# EAGLE design hev-controller 1.0 (EAGLE 6.1)
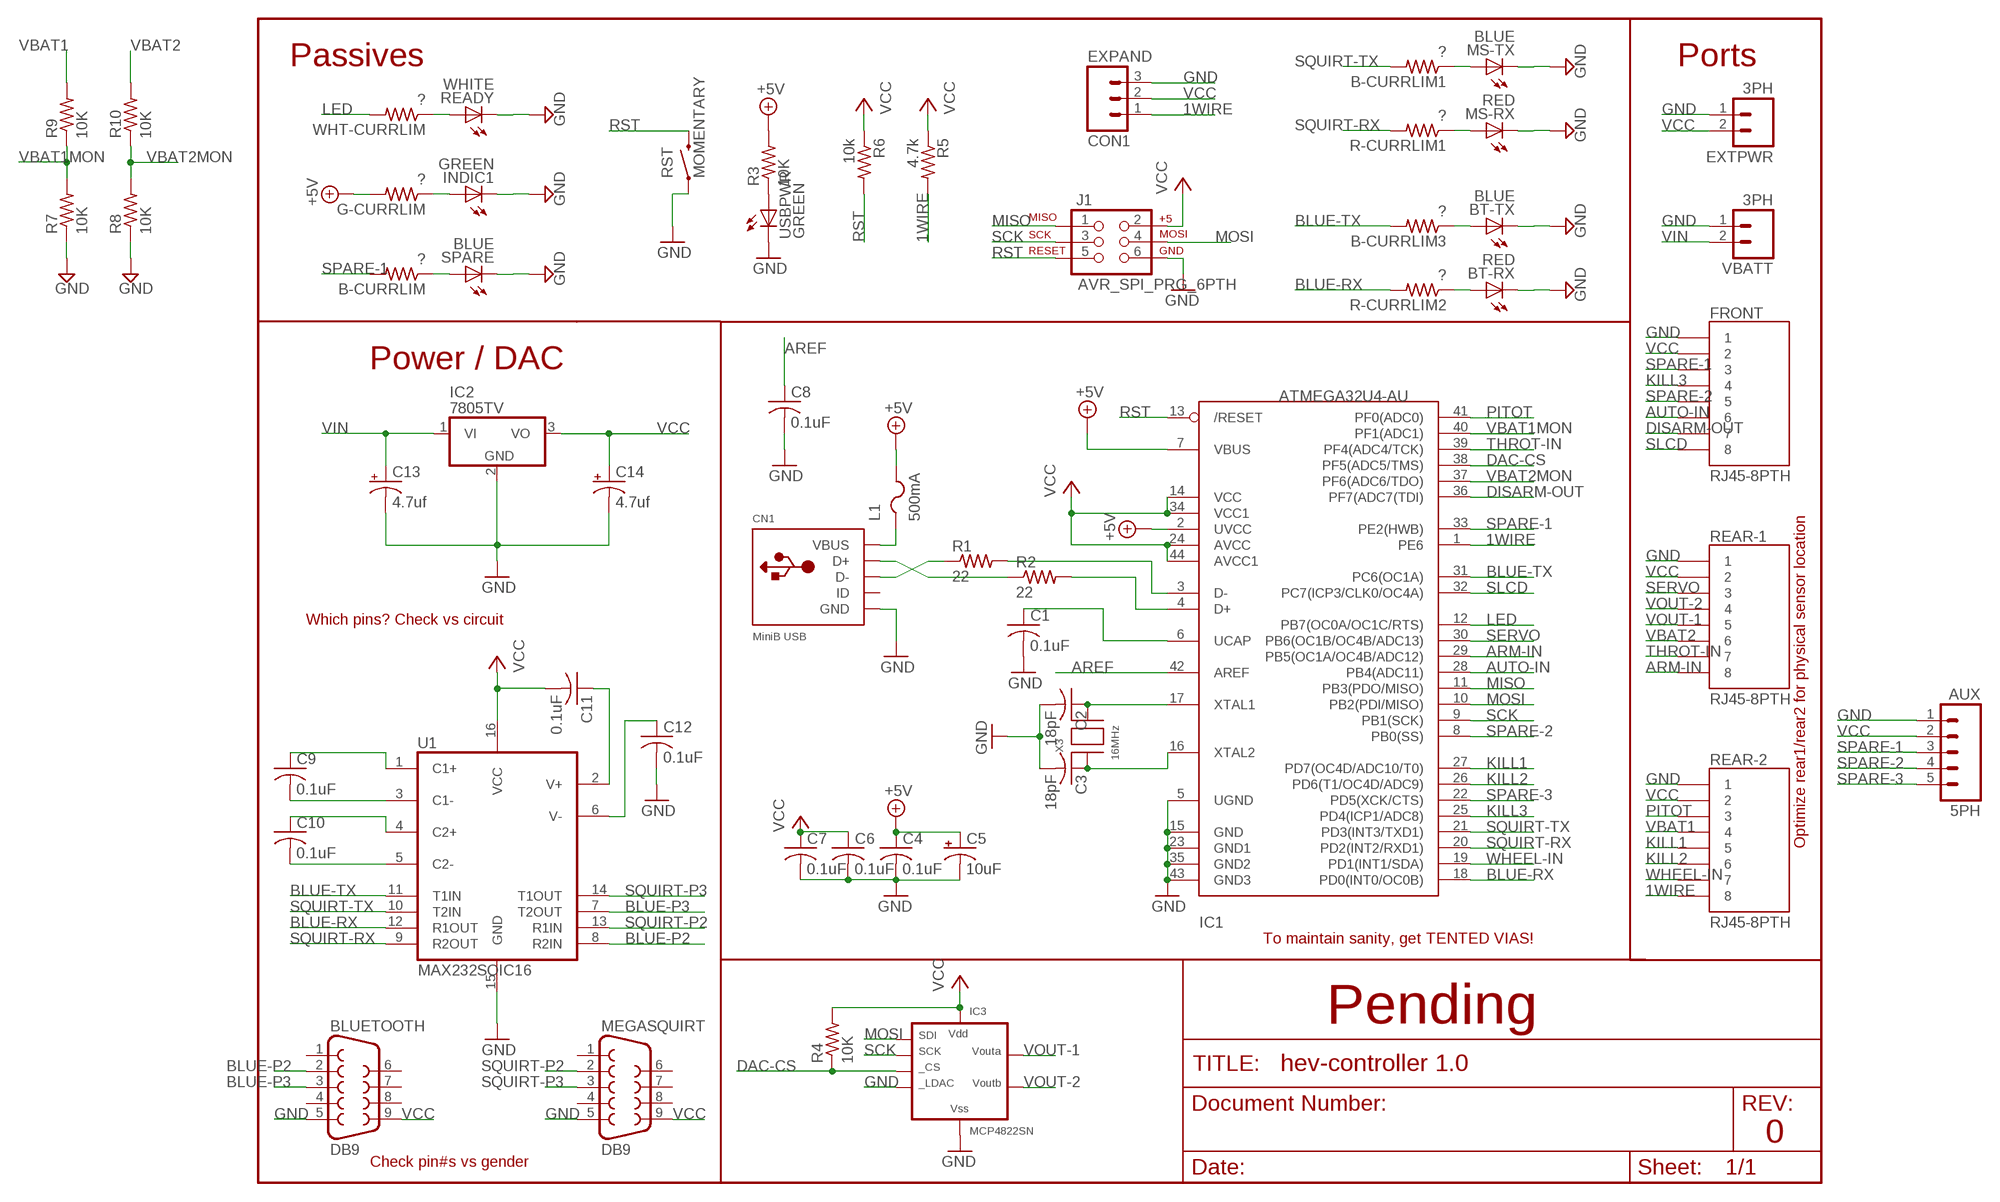
[diagram p0: schematic, sheet 1]

## Parts
5PH  AUX  M05PTH  [1X05]
B-CURRLIM  ?  R-US_R0805  [R0805]
B-CURRLIM1  ?  R-US_R0805  [R0805]
B-CURRLIM3  ?  R-US_R0805  [R0805]
BLUETOOTH  DB9  [DB9]
BT-RX  RED  LEDCHIPLED_0805  [CHIPLED_0805]
BT-TX  BLUE  LEDCHIPLED_0805  [CHIPLED_0805]
C1  0.1uF  C-USC0805K  [C0805K]
C2  18pF  C-USC0805K  [C0805K]
C3  18pF  C-USC0805K  [C0805K]
C4  0.1uF  C-USC0805K  [C0805K]
C5  10uF  CPOL-USA/3216-18R  [A/3216-18R]
C6  0.1uF  C-USC0805K  [C0805K]
C7  0.1uF  C-USC0805K  [C0805K]
C8  0.1uF  C-USC0805K  [C0805K]
C9  0.1uF  C-USC0805K  [C0805K]
C10  0.1uF  C-USC0805K  [C0805K]
C11  0.1uF  C-USC0805K  [C0805K]
C12  0.1uF  C-USC0805K  [C0805K]
C13  4.7uf  CPOL-USE2.5-6  [E2,5-6]
C14  4.7uf  CPOL-USE2.5-6  [E2,5-6]
CN1  MiniB USB  USBMINIB  [USB-MINIB]
EXPAND  CON1  M03POLAR  [MOLEX-1X3]
EXTPWR  3PH  M023.5MM  [SCREWTERMINAL-3.5MM-2]
FRONT  RJ45-8PTH  [RJ45-8]
G-CURRLIM  ?  R-US_R0805  [R0805]
IC1  ATMEGA32U4-AU  [TQFP44]
IC2  7805TV  [TO220V]
IC3  MCP4822SN  [SO-08]
INDIC1  GREEN  LEDCHIPLED_0805  [CHIPLED_0805]
J1  AVR_SPI_PRG_6PTH  [2X3]
L1  500mA  PTCFUSE-1206  [R1206]
MEGASQUIRT  DB9  [DB9]
MS-RX  RED  LEDCHIPLED_0805  [CHIPLED_0805]
MS-TX  BLUE  LEDCHIPLED_0805  [CHIPLED_0805]
R1  22  R-US_R0805  [R0805]
R2  22  R-US_R0805  [R0805]
R3  10K  R-US_R0805  [R0805]
R4  10K  R-US_R0805  [R0805]
R5  4.7k  R-US_R0805  [R0805]
R6  10k  R-US_R0805  [R0805]
R7  10K  R-US_R0805  [R0805]
R8  10K  R-US_R0805  [R0805]
R9  10K  R-US_R0805  [R0805]
R10  10K  R-US_R0805  [R0805]
R-CURRLIM1  ?  R-US_R0805  [R0805]
R-CURRLIM2  ?  R-US_R0805  [R0805]
READY  WHITE  LED1206  [LED-1206]
REAR-1  RJ45-8PTH  [RJ45-8]
REAR-2  RJ45-8PTH  [RJ45-8]
RST  MOMENTARY  SWITCH-MOMENTARY-2-SMD-1101NE  [TACTILE-SWITCH-1101NE]
SPARE  BLUE  LEDCHIPLED_0805  [CHIPLED_0805]
U1  MAX232SOIC16  [SO016]
USBPWR  GREEN  LEDCHIPLED_0805  [CHIPLED_0805]
VBATT  3PH  M023.5MM  [SCREWTERMINAL-3.5MM-2]
WHT-CURRLIM  ?  R-US_R0805  [R0805]
X3  16MHz  XTALNX5032  [NX5032]

## Nets
1WIRE: EXPAND.1 IC1.1(PE6) R5.2 REAR-2.8
+5V: C4.1 C5.+ G-CURRLIM.2 IC1.2(UVCC) IC1.7(VBUS) L1.2 R3.2
AREF: C8.1 IC1.42(AREF)
ARM-IN: IC1.29(PB5(OC1A/OC4B/ADC12)) REAR-1.8
AUTO-IN: FRONT.6 IC1.28(PB4(ADC11))
BLUE-P2: BLUETOOTH.2 U1.8(R2IN)
BLUE-P3: BLUETOOTH.3 U1.7(T2OUT)
BLUE-RX: IC1.18(PD0(INT0/OC0B)) R-CURRLIM2.2 U1.12(R1OUT)
BLUE-TX: B-CURRLIM3.2 IC1.31(PC6(OC1A)) U1.11(T1IN)
DAC-CS: IC1.38(PF5(ADC5/TMS)) IC3.2(CS) R4.1
DISARM-OUT: FRONT.7 IC1.36(PF7(ADC7(TDI))
GND [gnd]: 5PH.1 BLUETOOTH.5 BT-RX.C BT-TX.C C1.2 C2.2 C3.2 C4.2 C5.- C6.2 C7.2 C8.2 C12.2 C13.- C14.- CN1.GND EXPAND.3 EXTPWR.1 FRONT.1 IC1.5(UGND) IC1.15(GND) IC1.23(GND1) IC1.35(GND2) IC1.43(GND3) IC2.2(GND) IC3.5(LDAC) IC3.7(VSS) INDIC1.C J1.6 MEGASQUIRT.5 MS-RX.C MS-TX.C R7.1 R8.1 READY.C REAR-1.1 REAR-2.1 RST.P$1 SPARE.C U1.15(GND) USBPWR.C VBATT.1
KILL1: IC1.27(PD7(OC4D/ADC10/T0)) REAR-2.5
KILL2: IC1.26(PD6(T1/OC4D/ADC9)) REAR-2.6
KILL3: FRONT.4 IC1.25(PD4(ICP1/ADC8))
LED: IC1.12(PB7(OC0A/OC1C/RTS)) WHT-CURRLIM.2
MISO: IC1.11(PB3(PDO/MISO)) J1.1
MOSI: IC1.10(PB2(PDI/MISO)) IC3.4(SDI) J1.4
N$1: R3.1 USBPWR.A
N$2: CN1.D+ R2.1
N$3: IC1.3(D-) R1.2
N$4: IC1.4(D+) R2.2
N$5: CN1.D- R1.1
N$6: B-CURRLIM.1 SPARE.A
N$7: G-CURRLIM.1 INDIC1.A
N$8: C2.1 IC1.17(XTAL1) X3.P$2
N$9: C3.1 IC1.16(XTAL2) X3.P$1
N$10: B-CURRLIM1.1 MS-TX.A
N$11: MS-RX.A R-CURRLIM1.1
N$12: B-CURRLIM3.1 BT-TX.A
N$13: BT-RX.A R-CURRLIM2.1
N$25: READY.A WHT-CURRLIM.1
N$48: C9.1 U1.1(C1+)
N$49: C9.2 U1.3(C1-)
N$50: C10.1 U1.4(C2+)
N$51: C10.2 U1.5(C2-)
N$52: C11.1 U1.2(V+)
N$53: C12.1 U1.6(V-)
PITOT: IC1.41(PF0(ADC0)) REAR-2.3
RST: IC1.13(/RESET) J1.5 R6.2 RST.P$2
SCK: IC1.9(PB1(SCK)) IC3.3(SCK) J1.3
SERVO: IC1.30(PB6(OC1B/OC4B/ADC13)) REAR-1.3
SLCD: FRONT.8 IC1.32(PC7(ICP3/CLK0/OC4A))
SPARE-1: 5PH.3 B-CURRLIM.2 FRONT.3 IC1.33(PE2(HWB))
SPARE-2: 5PH.4 FRONT.5 IC1.8(PB0(SS))
SPARE-3: 5PH.5 IC1.22(PD5(XCK/CTS))
SQUIRT-P2: MEGASQUIRT.2 U1.13(R1IN)
SQUIRT-P3: MEGASQUIRT.3 U1.14(T1OUT)
SQUIRT-RX: IC1.20(PD2(INT2/RXD1)) R-CURRLIM1.2 U1.9(R2OUT)
SQUIRT-TX: B-CURRLIM1.2 IC1.21(PD3(INT3/TXD1)) U1.10(T2IN)
THROT-IN: IC1.39(PF4(ADC4/TCK)) REAR-1.7
UCAP: C1.1 IC1.6(UCAP)
VBAT1: R9.2 REAR-2.4
VBAT1MON: IC1.40(PF1(ADC1)) R7.2 R9.1
VBAT2: R10.2 REAR-1.6
VBAT2MON: IC1.37(PF6(ADC6/TDO)) R8.2 R10.1
VBUS: CN1.VBUS L1.1
VCC [power]: 5PH.2 BLUETOOTH.9 C6.1 C7.1 C11.2 C14.+ EXPAND.2 EXTPWR.2 FRONT.2 IC1.14(VCC) IC1.24(AVCC) IC1.34(VCC1) IC1.44(AVCC1) IC2.3(VO) IC3.1(VDD) J1.2 MEGASQUIRT.9 R4.2 R5.1 R6.1 REAR-1.2 REAR-2.2 U1.16(VCC)
VIN [power]: C13.+ IC2.1(VI) VBATT.2
VOUT-1: IC3.8(VOUTA) REAR-1.5
VOUT-2: IC3.6(VOUTB) REAR-1.4
WHEEL-IN: IC1.19(PD1(INT1/SDA)) REAR-2.7
Unconnected: BLUETOOTH.1 BLUETOOTH.4 BLUETOOTH.6 BLUETOOTH.7 BLUETOOTH.8 CN1.ID MEGASQUIRT.1 MEGASQUIRT.4 MEGASQUIRT.6 MEGASQUIRT.7 MEGASQUIRT.8

## Notes on the sheet
- Passives | Ports
- Power / DAC
- Which pins? Check vs circuit
- Optimize rear1/rear2 for physical sensor location
- To maintain sanity, get TENTED VIAS!
- Pending
- 0
- Check pin#s vs gender

## Library data of the parts
5PH = SparkFun:M05: Header 5 Standard 5-pin 0.1" header. Use with straight break away headers (SKU : PRT-00116), right angle break away headers (PRT-00553), swiss pins (PRT-00743), machine pins (PRT-00117), and female headers (PRT-00115). Molex polarized connector foot print use with SKU : PRT-08230 with associated crimp pins and housings.
B-CURRLIM B-CURRLIM1 B-CURRLIM3 G-CURRLIM R1-R10 R-CURRLIM1 R-CURRLIM2 WHT-CURRLIM = adafruit:R-US_: RESISTOR, American symbol
BLUETOOTH MEGASQUIRT = SparkFun:DB9: DB9 Connector Standard DB9 (D-Sub 9) serial connector. Can be used for CAN bus as well as RS485 and RS232. Footprint production proven. Spark Fun Electronics SKU : PRT-00429
BT-RX BT-TX INDIC1 MS-RX MS-TX SPARE USBPWR = adafruit:LED: LED OSRAM: - CHIPLED LG R971, LG N971, LY N971, LG Q971, LY Q971, LO R971, LY R971 LH N974, LH R974 LS Q976, LO Q976, LY Q976 LO Q996 - Hyper CHIPLED LW Q18S LB Q993, LB Q99A, LB R99A - SideLED LS A670, LO A670, LY A670, LG A670, LP A670 LB A673, LV A673, LT A673, LW A673 LH A674 LY A675 LS A676, LA A676, LO A676, LY A676, LW A676 LS A679, LY A679, LG A679 - Hyper Micro SIDELED® LS Y876, LA Y876, LO Y876, LY Y876 LT Y87S - SmartLED LW L88C, LW L88S LB L89C, LB L89S, LG L890 LS L89K, LO L89K, LY L89K LS L896, LA L896, LO L896, LY L896 - TOPLED LS T670, LO T670, LY T670, LG T670, LP T670 LSG T670, LSP T670, LSY T670, LOP T670, LYG T670 LG T671, LOG T671, LSG T671 LB T673, LV T673, LT T673, LW T673 LH T674 LS T676, LA T676, LO T676, LY T676, LB T676, LH T676, LSB T676, LW T676 LB T67C, LV T67C, LT T67C, LS T67K, LO T67K, LY T67K, LW E67C LS E67B, LA E67B, LO E67B, LY E67B, LB E67C, LV E67C, LT E67C LW T67C LS T679, LY T679, LG T679 LS T770, LO T770, LY T770, LG T770, LP T770 LB T773, LV T773, LT T773, LW T773 LH T774 LS E675, LA E675, LY E675, LS T675 LS T776, LA T776, LO T776, LY T776, LB T776 LHGB T686 LT T68C, LB T68C - Hyper Mini TOPLED® LB M676 - Mini TOPLED Santana® LG M470 LS M47K, LO M47K, LY M47K Source: http://www.osram.convergy.de/
C1-C4 C6-C12 = adafruit:C-US: CAPACITOR, American symbol
C5 = adafruit:CPOL-US: POLARIZED CAPACITOR, American symbol
C13 C14 = rcl:CPOL-US: POLARIZED CAPACITOR, American symbol
CN1 = adafruit:USB: USB Connectors USBMINIB - Surface Mount Female Mini-B USB Connector 4UConnector: 06564 By microbuilder.eu Thru-hole RA Female Mini-B USB Connector 4UConnector: 18732 By ladyada.net
EXPAND = SparkFun:M03: Header 3 Standard 3-pin 0.1" header. Use with straight break away headers (SKU : PRT-00116), right angle break away headers (PRT-00553), swiss pins (PRT-00743), machine pins (PRT-00117), and female headers (PRT-00115). Molex polarized connector foot print use with SKU : PRT-08232 with associated crimp pins and housings.
EXTPWR VBATT = SparkFun:M02: Header 2 Standard 2-pin 0.1" header. Use with straight break away headers (SKU : PRT-00116), right angle break away headers (PRT-00553), swiss pins (PRT-00743), machine pins (PRT-00117), and female headers (PRT-00115). Molex polarized connector foot print use with SKU : PRT-08233 with associated crimp pins and housings.
FRONT REAR-1 REAR-2 = SparkFun:RJ45-8: RJ45 Jack Simple RJ45, 8-pin connection - connector for common Cat5, Cat5e, and Cat6 Ethernet cables. Footprint not yet proven in production. Connector sku is PRT-00643; Breakout PCB sku is BOB-00716.
IC1 = adaprog:ATMEGA32U4
IC2 = linear:78*: Positive VOLTAGE REGULATOR Source: http://cache.national.com/ds/LM/LM78L05.pdf http://www.fairchildsemi.com/ds/LM/LM7805.pdf
IC3 = microchip-dac:MCP4822: MCP4822: 12-bit dual DAC MCP4802/4812/4822 - 8/10/12-Bit Dual Voltage Output Digital-to-Analog Converter with Internal VREF and SPI Interface The MCP48x2 devices are dual 8-bit, 10-bit and 12-bit buffered voltage output Digital-to-Analog Converters (DACs), respectively. The devices operate from a single 2.7V to 5.5V supply with SPI compatible Serial Peripheral Interface. The devices have a high precision internal voltage reference (VREF = 2.048V). The user can configure the full-scale range of the device to be 2.048V or 4.096V by setting the Gain Selection Option bit (gain of 1 of 2). RobG
J1 = SparkFun:AVR_SPI_PRG_6: AVR ISP 6 Pin This is the reduced ISP connector for AVR programming. Common on Arduino. This footprint will take up less PCB space and can be used with a 10-pin to 6-pin adapter such as SKU: BOB-08508
L1 = adafruit:PTCFUSE: PTC fuses, resettable thermistors
READY = SparkFun:LED: LEDs Standard schematic elements and footprints for 5mm, 3mm, 1206, and 0603 sized LEDs. 5mm - Spark Fun Electronics SKU : COM-00529 (and others)
RST = SparkFun:SWITCH-MOMENTARY-2
U1 = SparkFun:MAX232: RS232 Transceiver Very common IC. This is generically called 'MAX232', but works with the 3V equivalent MAX3232 generic ICs. Field tested and mother approved. Spark Fun Electronics SKU : COM-00316 (DIP) and COM-00589 (SMD)
X3 = adaprog:XTAL

## Net classes
0 default: width 0.254 mm
1 power: width 0.508 mm
2 gnd: width 0.508 mm

## Board
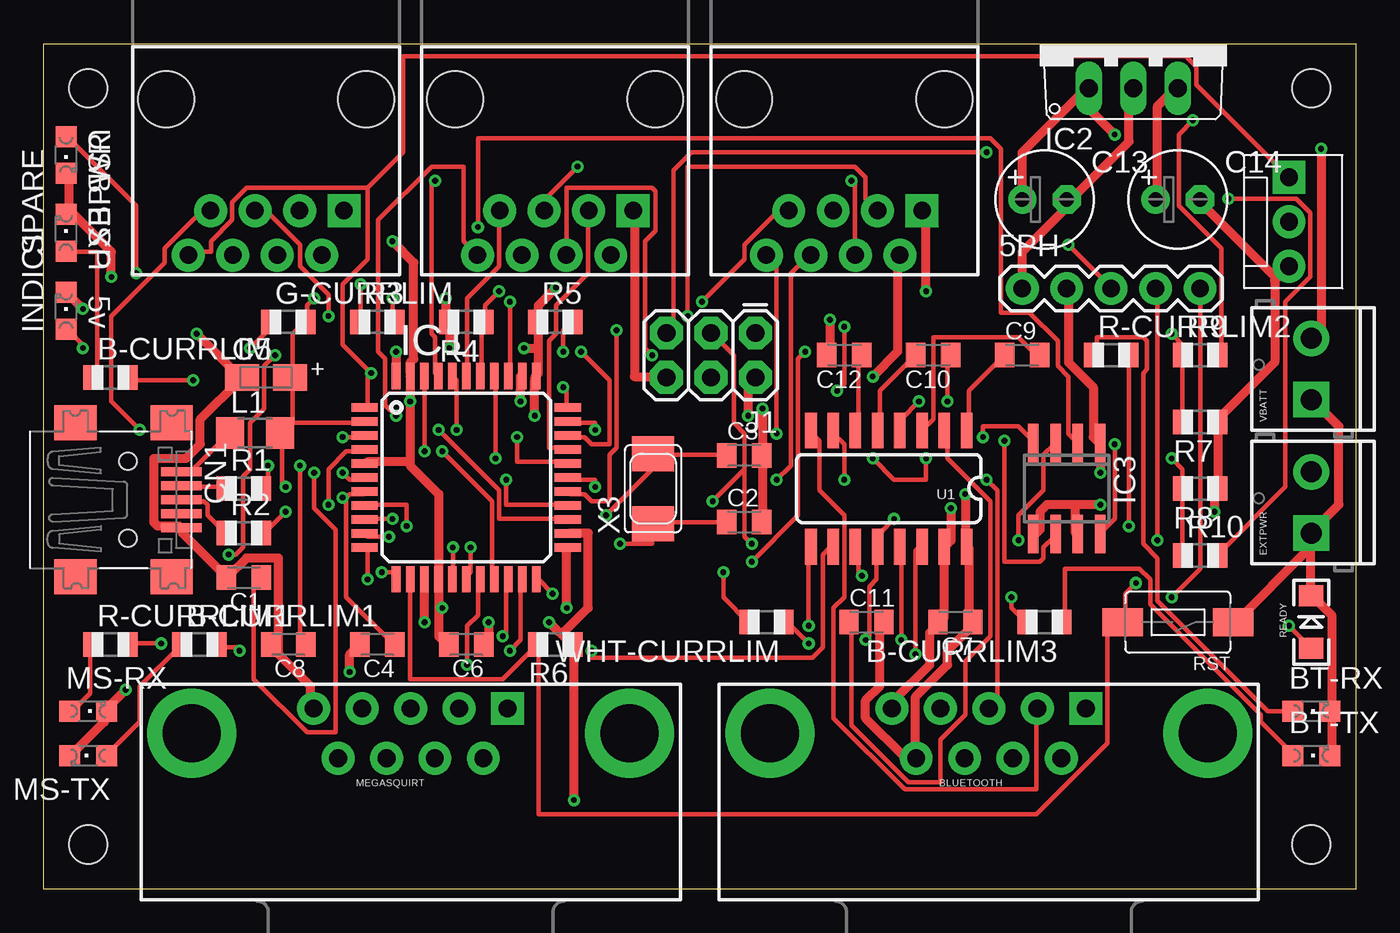
[diagram p1: board, top side]
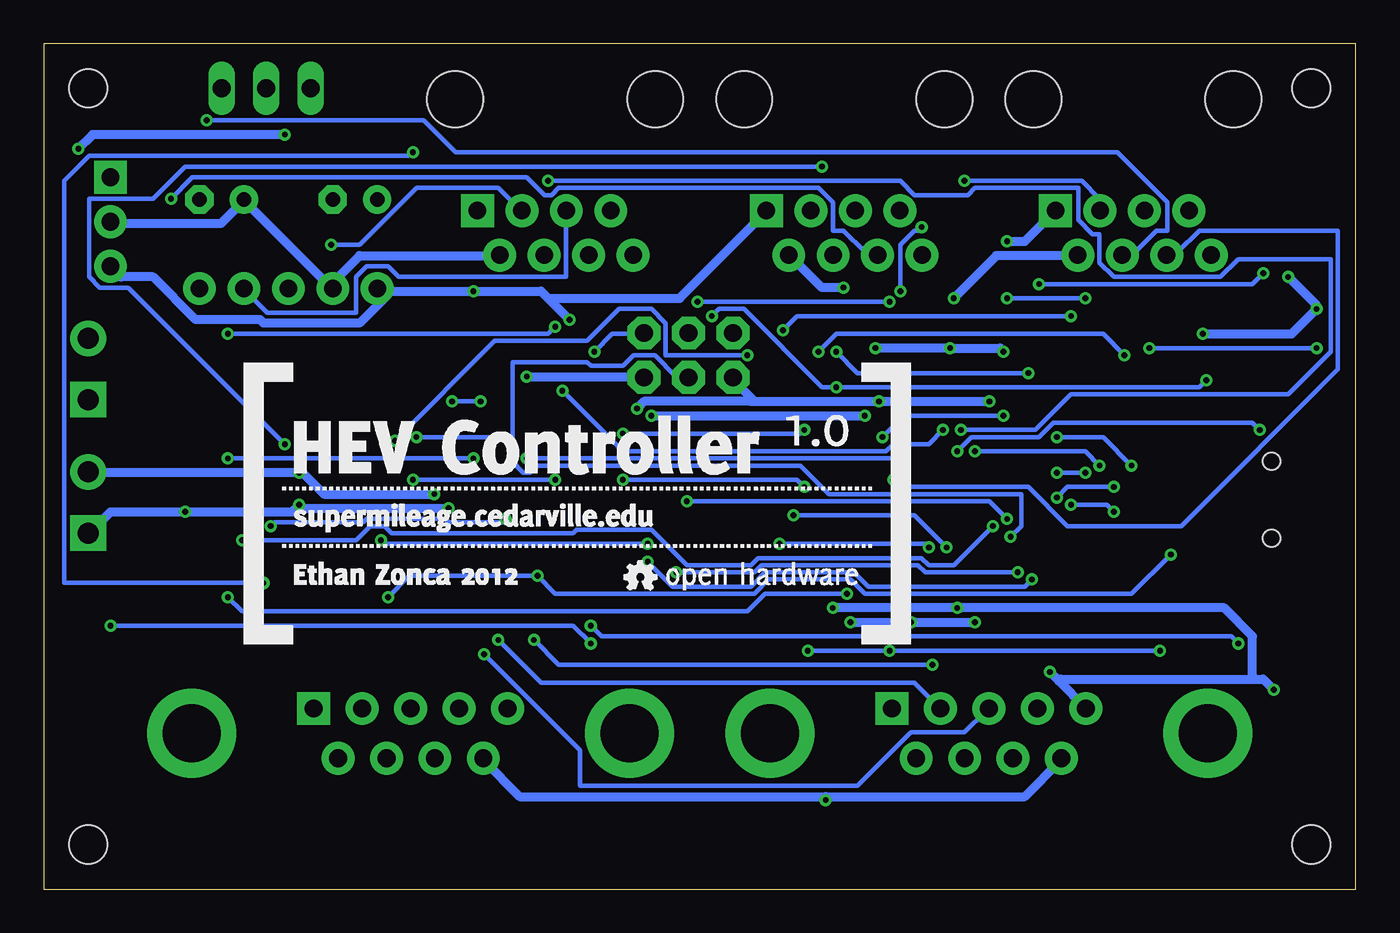
[diagram p2: board, bottom side, seen from below]

Size 74.93 x 48.26 mm. Coordinates in mm from the lower left corner, seen from the top.
Outline: 0,48.26 74.93,48.26 74.93,0 0,0 0,48.26
Copper layers (1*16): Top 0.0356mm / dielectric 1.5011mm / Bottom 0.0356mm
Design rules: minimum track width 6mil, minimum drill 13mil, track to track 6mil, track to pad 6mil, pad to pad 6mil, via to via 6mil, smd to smd 6mil, copper to edge 15mil, drill to drill 6mil, minimum pad ring 7mil, minimum via ring 7mil, stop-mask expansion 4mil, vias tented up to drill 15mil, thermal gap 10mil
Holes 2.2 mm at 2.54,45.72 72.39,45.72 72.39,2.54 2.54,2.54
tRestrict: area 4.2,23.7 to 5.5,25; area 4.2,19.4 to 5.5,20.7; area 5.2,43.3 to 8.8,46.9; area 16.6,43.3 to 20.2,46.9; area 21.7,43.3 to 25.3,46.9; area 33.1,43.3 to 36.7,46.9; area 38.2,43.3 to 41.8,46.9; area 49.7,43.3 to 53.2,46.9
bRestrict: area 5.2,43.3 to 8.8,46.9; area 16.6,43.3 to 20.2,46.9; area 21.7,43.3 to 25.3,46.9; area 33.1,43.3 to 36.7,46.9; area 38.2,43.3 to 41.8,46.9; area 49.7,43.3 to 53.2,46.9; area 4.2,23.7 to 5.5,25; area 4.2,19.4 to 5.5,20.7

### Footprints (pad centres in the part's own frame; a part is rotated, then mirrored left to right if it is on the bottom)
1X05 = drill 1.016 pad 1.88: 1 0,0; 2 2.54,0; 3 5.08,0; 4 7.62,0; 5 10.16,0
R0805 = smd 1.1 x 1.4: 1 -1,0; 2 1,0
DB9 = drill 1.016 pad 1.88 square: 1 -5.54,-1.42 | drill 1.016 pad 1.88: 2 -2.77,-1.42; 3 0,-1.42; 4 2.77,-1.42; 5 5.54,-1.42; 6 -4.15,1.42; 7 -1.38,1.42; 8 1.38,1.42; 9 4.15,1.42 | drill 3.302 pad 5.08: G1 -12.5,0; G2 12.5,0
CHIPLED_0805 = smd 1.2 x 1.2: A 0,-1.05; C 0,1.05
C0805K = smd 1.1 x 1.4: 1 -1,0; 2 1,0
A/3216-18R = smd 1.95 x 1.5: + 1.375,0; - -1.375,0
E2,5-6 = drill 0.813 pad 1.6: + -1.27,0 | drill 0.813 pad 1.6 octagon: - 1.27,0
USB-MINIB = smd 0.5 x 2.308: D+ 0,4.064; D- -0.8,4.064; GND 1.6,4.064; ID 0.8,4.064; VBUS -1.6,4.064 | smd 2 x 2.4: GND1 -4.4,-2; GND2 -4.4,3.5; GND3 4.4,3.5; GND4 4.4,-2 | hole 1: -2.2,1; 2.2,1
MOLEX-1X3 = drill 1.016 pad 1.88 square: 1 0,0 | drill 1.016 pad 1.88: 2 2.54,0; 3 5.08,0
SCREWTERMINAL-3.5MM-2 = drill 1.2 pad 2.032 square: 1 0,0 | drill 1.2 pad 2.032: 2 3.5,0
RJ45-8 = drill 1 pad 1.88 square: 1 -4.445,6.35 | drill 1 pad 1.88: 2 -3.175,8.89; 3 -1.905,6.35; 4 -0.635,8.89; 5 0.635,6.35; 6 1.905,8.89; 7 3.175,6.35; 8 4.445,8.89 | hole 3.2: -5.715,0; 5.715,0
TQFP44 = smd 1.5 x 0.5: 1 -5.8,4; 2 -5.8,3.2; 3 -5.8,2.4; 4 -5.8,1.6; 5 -5.8,0.8; 6 -5.8,0; 7 -5.8,-0.8; 8 -5.8,-1.6; 9 -5.8,-2.4; 10 -5.8,-3.2; 11 -5.8,-4; 23 5.8,-4; 24 5.8,-3.2; 25 5.8,-2.4; 26 5.8,-1.6; 27 5.8,-0.8; 28 5.8,0; 29 5.8,0.8; 30 5.8,1.6; 31 5.8,2.4; 32 5.8,3.2; 33 5.8,4 | smd 0.5 x 1.5: 12 -4,-5.8; 13 -3.2,-5.8; 14 -2.4,-5.8; 15 -1.6,-5.8; 16 -0.8,-5.8; 17 0,-5.8; 18 0.8,-5.8; 19 1.6,-5.8; 20 2.4,-5.8; 21 3.2,-5.8; 22 4,-5.8; 34 4,5.8; 35 3.2,5.8; 36 2.4,5.8; 37 1.6,5.8; 38 0.8,5.8; 39 0,5.8; 40 -0.8,5.8; 41 -1.6,5.8; 42 -2.4,5.8; 43 -3.2,5.8; 44 -4,5.8
TO220V = drill 1.016 long: 1 -2.54,-2.54; 2 0,-2.54; 3 2.54,-2.54
SO-08 = smd 0.6 x 2.2: 1 -1.905,-2.6; 2 -0.635,-2.6; 3 0.635,-2.6; 4 1.905,-2.6; 5 1.905,2.6; 6 0.635,2.6; 7 -0.635,2.6; 8 -1.905,2.6
2X3 = drill 1.016 pad 1.88 octagon: 1 0,0; 2 0,2.54; 3 2.54,0; 4 2.54,2.54; 5 5.08,0; 6 5.08,2.54
R1206 = smd 1.6 x 1.803: 1 -1.422,0; 2 1.422,0
LED-1206 = smd 1.2 x 1.4: A -1.5,0; C 1.5,0
TACTILE-SWITCH-1101NE = smd 2.3 x 1.6: P$1 -3.15,0; P$2 3.15,0
SO016 = smd 0.66 x 2.032: 1 -4.445,-3.315; 2 -3.175,-3.315; 3 -1.905,-3.315; 4 -0.635,-3.315; 5 0.635,-3.315; 6 1.905,-3.315; 7 3.175,-3.315; 8 4.445,-3.315; 9 4.445,3.315; 10 3.175,3.315; 11 1.905,3.315; 12 0.635,3.315; 13 -0.635,3.315; 14 -1.905,3.315; 15 -3.175,3.315; 16 -4.445,3.315
NX5032 = smd 2 x 2.4: P$1 2,0; P$2 -2,0

### Placement (x,y rotation side)
5PH  55.88,34.29 0 top
B-CURRLIM  3.81,29.21 0 top
B-CURRLIM1  8.89,13.97 0 top
B-CURRLIM3  57.15,15.24 180 top
BLUETOOTH  53.98,8.89 180 top
BT-RX  72.39,10.16 270 top
BT-TX  72.39,7.62 270 top
C1  11.43,17.78 180 top
C2  40.01,20.95 0 top
C3  40.01,24.76 0 top
C4  19.05,13.97 180 top
C5  12.7,29.21 0 top
C6  24.13,13.97 180 top
C7  52.07,15.24 180 top
C8  13.97,13.97 180 top
C9  55.88,30.48 0 top
C10  50.8,30.48 180 top
C11  46.99,15.24 0 top
C12  45.72,30.48 180 top
C13  57.15,39.37 0 top
C14  64.77,39.37 0 top
CN1  3.81,22.22 270 top
EXPAND  71.12,40.64 270 top
EXTPWR  72.39,20.32 90 top
FRONT  45.72,45.08 180 top
G-CURRLIM  13.97,32.39 0 top
IC1  24.13,23.5 0 top
IC2  62.23,48.26 0 top
IC3  58.42,22.86 180 top
INDIC1  1.27,33.02 0 top
J1  40.64,31.75 180 top
L1  12.06,26.04 0 top
MEGASQUIRT  20.95,8.89 180 top
MS-RX  2.54,10.16 270 top
MS-TX  2.54,7.62 90 top
R1  11.43,22.86 0 top
R2  11.43,20.32 0 top
R3  19.05,32.39 0 top
R4  24.13,32.39 180 top
R5  29.21,32.39 0 top
R6  29.21,13.97 180 top
R7  66.04,26.67 180 top
R8  66.04,22.86 180 top
R9  66.04,30.48 0 top
R10  66.04,19.05 0 top
R-CURRLIM1  3.81,13.97 0 top
R-CURRLIM2  60.96,30.48 0 top
READY  72.39,15.24 90 top
REAR-1  29.21,45.08 180 top
REAR-2  12.7,45.08 180 top
RST  64.77,15.24 180 top
SPARE  1.27,37.47 0 top
U1  48.26,22.86 180 top
U$1  [SM-HEVLOGO]  25.4,13.97 0 top
USBPWR  1.27,41.91 180 top
VBATT  72.39,27.94 90 top
WHT-CURRLIM  41.27,15.24 180 top
X3  34.8,22.86 90 top

### Tracks (layer width: path | path; a pad name or v marks a point on that pad's centre or on a via)
1WIRE  (via drill 0.33)
  Top 0.254: v29.67,30.68 29.67,31.9 30.07,32.31 R5.2 | IC1.1 18.49,27.64 18.49,29.26 v18.69,29.46 17.07,31.09 17.07,34.54 18.49,35.97 18.49,40.03 | 18.49,40.03 11.58,40.03 10.77,39.22 10.77,38.2 9.55,36.98 9.55,36.37 8.33,36.37 REAR-2.8 | EXPAND.1 65.84,45.92 65.84,46.94 65.23,47.55 20.52,47.55 20.52,42.06 18.49,40.03
  Bottom 0.254: v29.67,30.68 28.45,29.46 v18.69,29.46
+5V  (via drill 0.33)
  Top 0.254: 17.27,22.35 17.27,16.66 19.91,14.02 C4.1 | 17.27,22.35 17.48,22.56 18.29,22.56 IC1.7 | 14.22,26.62 13.61,26.62 13.61,26.21 L1.2 | 14.22,26.62 18.29,26.62 IC1.2 | v19.91,33.73 19.91,32.51 R3.2 | v15.44,33.73 15.04,33.33 15.04,32.51 G-CURRLIM.2 14.83,32.31 14.22,31.7 14.22,29.26 C5.+ 14.22,29.06 14.22,26.62 | 14.22,26.62 L1.2 | v17.07,22.35 17.27,22.35 | v13.82,22.96 13.61,23.17 13.61,26.01 L1.2
  Bottom 0.254: v15.44,33.73 v19.91,33.73 | v17.07,22.35 16.46,22.96 v13.82,22.96
AREF  (via drill 0.33)
  Top 0.254: v14.63,24.18 14.63,14.22 14.83,14.02 C8.1 | v21.74,24.99 21.74,29.26 IC1.42
  Bottom 0.254: v14.63,24.18 15.44,24.99 v21.74,24.99
ARM-IN  (via drill 0.33)
  Top 0.254: v27.03,25.81 27.03,24.38 29.87,24.38 IC1.29 | v20.12,27.03 19.51,27.64 19.51,30.28 19.1,30.68 19.1,38.2 22.15,41.25 23.98,41.25 23.98,36.98 24.59,36.37 REAR-1.8
  Bottom 0.254: v27.03,25.81 25.81,27.03 v20.12,27.03
AUTO-IN  (via drill 0.33)
  Top 0.254: v31.5,22.96 31.5,23.37 30.07,23.37 IC1.28 | v41.86,23.37 42.67,24.18 42.67,35.15 43.69,36.17 FRONT.6
  Bottom 0.254: v31.5,22.96 31.9,23.37 v41.86,23.37
BLUE-P2
  Top 0.254: U1.8 43.89,26.01 44.3,25.6 44.3,22.76 45.72,21.34 45.72,16.66 45.11,16.05 45.11,9.75 49.17,5.69 56.69,5.69 56.69,10.16 BLUETOOTH.2
BLUE-P3  (via drill 0.33)
  Top 0.254: v45.72,23.37 45.72,25.4 45.11,26.01 U1.7 | v53.85,23.37 54.46,22.76 54.46,10.77 54.05,10.36 BLUETOOTH.3
  Bottom 0.254: v53.85,23.37 v45.72,23.37
BLUE-RX  (via drill 0.33)
  Top 0.254: v61.98,20.73 61.98,30.48 R-CURRLIM2.2 | v48.56,21.13 47.75,20.32 47.75,19.71 U1.12 47.55,19.51 47.55,17.68 47.14,17.27 47.14,14.43 v46.94,14.22 | v24.18,12.8 24.18,15.04 24.79,15.65 24.79,17.68 IC1.18
  Bottom 0.254: v61.98,20.73 61.77,20.93 56.69,20.93 56.49,21.13 52.02,21.13 51.82,20.93 48.77,20.93 v48.56,21.13 | v24.18,12.8 45.52,12.8 v46.94,14.22
BLUE-TX  (via drill 0.33)
  Top 0.254: v55.27,16.66 55.27,16.05 56.08,15.24 B-CURRLIM3.2 | v46.74,17.88 46.53,18.09 46.53,19.51 U1.11 | v30.68,30.68 32.31,29.06 32.31,25.4 31.29,25.4 30.89,25.81 30.07,25.81 IC1.31 | v13.21,30.48 12.6,29.87 12.6,27.43 11.79,26.62 11.79,23.98 11.38,23.57 11.38,19.51 10.97,19.1 v10.57,19.1
  Bottom 0.254: v55.27,16.66 54.05,17.88 v46.74,17.88 45.72,16.87 34.34,16.87 33.53,17.68 28.85,17.68 28.04,16.87 12.8,16.87 v10.57,19.1 | v30.68,30.68 29.67,31.7 14.43,31.7 v13.21,30.48
DAC-CS  (via drill 0.33)
  Top 0.254: IC1.38 24.99,29.46 24.99,32.31 R4.1 25.2,32.51 25.2,33.33 v26.01,34.14 | v24.79,37.8 24.79,42.88 54.05,42.88 54.66,42.27 54.66,32.92 56.29,32.92 57.91,31.29 57.91,29.87 58.52,29.26 58.52,26.01 58.93,25.6 IC3.2
  Bottom 0.254: v24.79,37.8 24.99,37.59 25.2,37.59 26.01,36.78 v26.01,34.14
DISARM-OUT  (via drill 0.33)
  Top 0.254: v26.62,33.53 26.62,29.46 IC1.36 | v37.59,33.53 40.03,35.97 40.03,36.78 41.86,38.61 42.47,38.61 FRONT.7
  Bottom 0.254: v37.59,33.53 v26.62,33.53
GND  (via drill 0.33)
  Top 0.508: 22.55,16.05 22.55,17.68 IC1.15 22.55,17.88 22.55,22.56 20.93,24.18 20.93,24.38 | 22.55,16.05 22.55,14.43 22.96,14.02 C6.2 | v29.87,16.05 29.87,19.3 IC1.23 | v22.76,16.05 22.55,16.05 | 20.93,24.38 18.49,24.38 IC1.5 | 20.93,24.38 v20.93,27.84 20.93,29.26 IC1.43 20.93,29.46 20.93,30.07 21.13,30.28 21.13,35.76 v19.91,36.98 | USBPWR.C 1.42,40.84 1.42,38.61 SPARE.C 1.63,38.61 3.86,36.37 v3.86,34.95 | v2.23,33.12 1.42,33.93 INDIC1.C | v8.74,31.7 11.18,29.26 C5.- 11.18,29.06 8.94,26.82 8.94,25.4 8.13,24.59 6.3,24.59 6.3,20.93 6.5,20.73 7.72,20.73 CN1.GND 7.92,20.52 7.92,20.32 10.36,17.88 C1.2 10.57,17.88 11.58,18.9 13.41,18.9 13.41,13.61 C8.2 13.01,13.82 15.24,11.58 15.24,10.36 MEGASQUIRT.5 | MS-TX.C 1.63,7.72 3.45,9.55 3.45,10.16 MS-RX.C 3.66,10.36 v4.67,11.38 | v17.48,12.39 17.48,13.41 17.88,13.82 C4.2 | BLUETOOTH.5 48.56,10.36 48.56,10.77 50.6,12.8 50.6,14.63 51,15.04 C7.2 51.21,15.24 51.41,15.44 51.41,19.51 U1.15 51.61,19.71 51.82,19.91 v51.82,21.74 | 58.93,21.95 57.3,21.95 56.9,21.54 56.9,20.52 56.69,20.32 IC3.5 | 58.93,21.95 58.93,20.32 IC3.7 | BT-TX.C 73.56,7.72 73.56,10.16 BT-RX.C 73.56,10.36 73.56,15.65 72.54,16.66 READY.C 72.34,16.87 72.34,19.3 | 72.34,19.3 72.34,20.32 EXTPWR.1 72.54,20.52 73.97,21.95 73.97,26.42 72.54,27.84 VBATT.1 | RST.P$1 68.07,15.24 72.14,19.3 72.34,19.3 | v60.35,21.95 59.13,21.95 58.93,21.95 | 70.31,34.75 70.31,30.07 67.06,26.82 R7.1 67.06,26.62 67.06,22.96 R8.1 66.85,22.76 v66.85,21.54 | EXPAND.3 70.31,34.75 | C14.- 66.04,39.22 70.31,34.95 70.31,34.75 | C2.2 41.05,21.13 41.05,24.59 C3.2 41.05,24.99 v41.05,27.43 | v27.23,27.84 27.23,29.26 IC1.35
  Top 0.508: IC2.2 62.18,45.72 61.98,45.52 61.98,42.67 58.52,39.22 C13.- 58.52,39.01 55.88,36.37 55.88,34.34 5PH.1 | v44.91,32.51 44.91,30.48 C12.2 | v50.39,34.14 50.39,38.41 50.19,38.61 FRONT.1 | J1.6 35.56,29.26 33.73,29.26 33.73,38.61 REAR-1.1
  Bottom 0.508: v29.87,16.05 v22.76,16.05 22.55,16.05 7.52,16.05 5.89,14.43 5.89,12.19 5.89,11.99 | v19.91,36.98 18.9,36.98 17.27,38.61 REAR-2.1 | v8.74,31.7 3.66,31.7 v2.23,33.12 2.23,33.33 v3.86,34.95 | 16.97,11.89 15.44,10.36 MEGASQUIRT.5 | 16.97,11.89 v17.48,12.39 | v4.67,11.38 5.28,11.99 5.89,11.99 | 5.89,11.99 16.87,11.99 16.97,11.89 | EXTPWR.1 72.34,20.32 71.12,21.54 v66.85,21.54 60.76,21.54 v60.35,21.95 60.35,21.74 v51.82,21.74 | 34.34,27.84 v27.23,27.84 27.03,27.84 v20.93,27.84 | 34.34,27.84 35.56,29.06 J1.6 | v41.05,27.43 40.64,27.84 34.54,27.84 34.34,27.84 | 46.02,33.63 46.53,34.14 v50.39,34.14 55.88,34.14 5PH.1 55.27,33.93 56.9,32.31 62.38,32.31 62.59,32.51 66.24,32.51 68.68,34.95 70.51,34.95 EXPAND.3 | 46.02,33.63 v44.91,32.51 | REAR-1.1 33.73,38.61 38.61,33.73 45.92,33.73 46.02,33.63
KILL1  (via drill 0.33)
  Top 0.254: v32.72,31.9 32.72,25.2 32.31,24.79 32.31,22.15 31.29,22.15 30.89,22.56 30.07,22.56 IC1.27 | v16.26,32.72 16.26,33.93 14.63,35.56 14.63,36.78 12.8,38.61 12.19,38.61 REAR-2.5
  Bottom 0.254: v32.72,31.9 31.9,32.72 v16.26,32.72
KILL2  (via drill 0.33)
  Top 0.254: v26.42,23.37 26.42,21.95 29.87,21.95 IC1.26
  Bottom 0.254: v26.42,23.37 26.01,22.96 18.69,22.96 16.46,20.73 9.96,20.73 1.02,29.67 1.02,37.59 8.94,37.59 10.16,36.37 10.77,36.37 REAR-2.6
KILL3  (via drill 0.33)
  Top 0.254: v22.55,26.21 26.01,22.76 26.01,21.13 29.87,21.13 IC1.25 | v46.13,40.44 46.33,40.23 46.33,36.37 FRONT.4
  Bottom 0.254: v22.55,26.21 18.29,26.21 16.26,28.25 3.86,28.25 1.42,30.68 1.42,35.97 6.71,35.97 7.72,34.95 13.82,34.95 14.63,35.76 14.63,37.39 15.04,37.39 15.85,38.2 15.85,40.03 21.74,40.03 22.15,39.62 25.2,39.62 26.01,40.44 v46.13,40.44
LED  (via drill 0.33)
  Top 0.254: v38.81,18.09 38.81,16.66 40.23,15.24 WHT-CURRLIM.2 | v19.3,18.09 20.12,18.09 20.12,17.88 IC1.12
  Bottom 0.254: v38.81,18.09 34.34,18.09 33.93,18.49 24.99,18.49 24.59,18.09 v19.3,18.09
MISO  (via drill 0.33)
  Top 0.254: v18.49,17.68 18.49,19.3 IC1.11 | v40.44,18.69 43.08,21.34 43.08,30.28 v43.48,30.68
  Bottom 0.254: v18.49,17.68 18.9,17.27 27.84,17.27 28.65,18.09 33.73,18.09 34.54,17.27 39.01,17.27 v40.44,18.69 | v43.48,30.68 42.47,31.7 40.64,31.7 J1.1
MOSI  (via drill 0.33)
  Top 0.254: v19.71,20.12 18.49,20.12 IC1.10 | v53.65,25.81 53.65,26.42 55.68,26.42 56.49,25.6 IC3.4
  Bottom 0.254: v19.71,20.12 19.1,20.73 19.1,22.56 30.07,22.56 31.7,24.18 46.74,24.18 47.14,23.77 47.55,23.77 48.16,24.38 48.16,25.81 | 48.16,25.81 48.16,30.07 43.89,30.07 43.69,29.87 41.86,29.87 41.25,30.48 40.03,30.48 38.81,29.26 38.2,29.26 J1.4 | 48.16,25.81 v53.65,25.81
N$1  (via drill 0.33)
  Top 0.254: v5.28,35.15 5.28,39.01 1.42,42.88 USBPWR.A | v18.09,34.54 18.09,32.51 R3.1
  Bottom 0.254: v5.28,35.15 5.89,34.54 v18.09,34.54
N$2
  Top 0.254: R2.1 10.36,20.32 9.35,21.34 9.35,21.95 9.14,22.15 7.92,22.15 CN1.D+
N$3  (via drill 0.33)
  Top 0.254: v12.8,24.18 12.8,23.17 12.6,22.96 R1.2 | v17.07,25.81 18.29,25.81 IC1.3
  Bottom 0.254: v12.8,24.18 14.43,25.81 v17.07,25.81
N$4  (via drill 0.33)
  Top 0.254: v13.82,21.54 12.6,20.32 R2.2 | v16.26,21.95 16.26,23.98 17.27,24.99 18.29,24.99 IC1.4
  Bottom 0.254: v13.82,21.54 14.22,21.95 v16.26,21.95
N$5
  Top 0.254: R1.1 10.36,22.96 7.92,22.96 CN1.D-
N$6
  Top 0.254: SPARE.A 1.42,36.37 3.05,36.37 3.05,29.46 2.85,29.26 B-CURRLIM.1
N$7  (via drill 0.33)
  Top 0.254: v2.23,30.89 2.23,31.09 1.42,31.9 INDIC1.A | v11.79,30.89 12.8,31.9 12.8,32.31 G-CURRLIM.1
  Bottom 0.254: v11.79,30.89 v2.23,30.89
N$8  (via drill 0.33)
  Top 0.254: C2.1 38.81,20.93 34.95,20.93 X3.P$2 34.75,20.73 34.75,19.71 v32.92,19.71 | v24.38,19.51 24.38,18.09 24.18,17.88 IC1.17
  Bottom 0.254: v24.38,19.51 24.59,19.71 v32.92,19.71
N$9  (via drill 0.33)
  Top 0.254: C3.1 38.81,24.79 34.95,24.79 X3.P$1 34.75,24.79 34.75,23.98 v32.11,21.34 | v23.37,19.51 23.37,17.88 IC1.16
  Bottom 0.254: v23.37,19.51 25.2,21.34 v32.11,21.34
N$10
  Top 0.254: MS-TX.A 3.66,7.72 5.49,9.55 5.49,11.58 7.72,13.82 B-CURRLIM1.1
N$11
  Top 0.254: MS-RX.A 1.63,10.16 2.64,11.18 2.64,13.82 R-CURRLIM1.1
N$12
  Top 0.254: BT-TX.A 71.32,7.72 69.49,9.55 69.49,9.96 63.2,16.26 63.2,17.68 62.59,18.29 58.32,18.29 58.32,15.24 B-CURRLIM3.1
N$13
  Top 0.254: BT-RX.A 71.32,10.16 69.9,10.16 63.6,16.46 63.6,18.9 62.79,19.71 62.79,29.46 62.99,29.67 62.99,31.29 62.79,31.5 60.15,31.5 60.15,30.48 R-CURRLIM2.1
N$25  (via drill 0.33)
  Top 0.254: v43.69,14.02 42.47,15.24 WHT-CURRLIM.1 | v71.12,15.04 72.34,13.82 READY.A
  Bottom 0.254: v43.69,14.02 44.7,15.04 v71.12,15.04
N$48
  Top 0.254: C9.1 54.86,30.48 52.83,28.45 52.83,26.21 U1.1
N$49
  Top 0.254: C9.2 56.69,30.48 55.68,31.5 50.8,31.5 50.8,26.82 50.19,26.21 U1.3
N$50  (via drill 0.33)
  Top 0.254: v51.61,27.84 51.61,30.48 C10.1 | v49.99,27.84 48.97,26.82 48.97,26.21 U1.4
  Bottom 0.254: v49.99,27.84 v51.61,27.84
N$51
  Top 0.254: C10.2 49.78,30.48 47.75,28.45 47.75,26.21 U1.5
N$52
  Top 0.254: C11.1 46.13,15.24 46.13,9.35 49.38,6.1 51.21,6.1 51.21,8.53 52.63,9.96 52.63,13 54.05,14.43 54.05,22.15 51.61,24.59 51.61,26.01 U1.2
N$53
  Top 0.254: C12.1 46.53,30.48 46.53,26.21 U1.6
PITOT  (via drill 0.33)
  Top 0.254: v22.35,40.44 22.15,40.23 22.15,31.7 22.35,31.5 22.35,29.46 IC1.41
  Bottom 0.254: v22.35,40.44 15.65,40.44 14.63,39.42 14.63,38.81 REAR-2.3
RST  (via drill 0.33)
  Top 0.254: IC1.13 20.93,17.68 20.93,11.99 26.21,11.99 28.04,13.82 R6.2 28.25,13.82 28.25,4.27 56.69,4.27 60.76,8.33 60.76,14.43 61.57,15.24 RST.P$2 61.77,15.24 61.77,16.87 v62.38,17.48 | v53.85,42.06 36.98,42.06 35.97,41.05 35.97,32.31 35.56,31.9 J1.5
  Bottom 0.254: v53.85,42.06 54.05,41.86 72.34,41.86 73.76,40.44 73.76,17.48 v62.38,17.48
SCK  (via drill 0.33)
  Top 0.254: v19.91,21.13 18.49,21.13 IC1.9 | 40.03,23.98 v38.2,22.15 | 40.03,23.98 40.03,26.01 39.42,26.62 39.42,30.48 38.2,31.7 J1.3 | v55.68,19.91 55.68,21.34 57.1,22.76 57.1,24.79 57.71,25.4 IC3.3 | v40.44,19.71 40.03,20.12 40.03,23.98
  Bottom 0.254: v19.91,21.13 20.93,22.15 v38.2,22.15 | v55.68,19.91 55.47,19.71 v40.44,19.71
SERVO
  Top 0.254: IC1.30 29.87,25.2 28.85,25.2 28.85,31.29 29.26,31.7 29.26,33.33 31.09,35.15 31.09,38.61 REAR-1.3
SLCD  (via drill 0.33)
  Top 0.254: v31.5,26.21 31.5,26.62 30.07,26.62 IC1.32 | v41.86,26.01 41.86,35.76 41.45,36.17 FRONT.8
  Bottom 0.254: v31.5,26.21 31.7,26.01 v41.86,26.01
SPARE-1  (via drill 0.33)
  Top 0.254: v58.52,36.78 60.96,34.34 5PH.3 | v8.53,29.06 4.88,29.06 B-CURRLIM.2 | v29.67,28.65 29.87,28.45 29.87,27.64 IC1.33 | v36.78,32.72 36.78,41.25 46.33,41.25 46.94,40.64 46.94,39.42 47.55,38.81 FRONT.3
  Bottom 0.254: v58.52,36.78 56.9,36.78 53.65,40.03 48.97,40.03 47.75,38.81 FRONT.3 | v8.53,29.06 8.94,28.65 v29.67,28.65 30.48,28.65 34.95,33.12 36.37,33.12 v36.78,32.72
SPARE-2  (via drill 0.33)
  Top 0.254: v20.73,20.73 20.73,21.95 18.49,21.95 IC1.8 | v63.6,19.91 63.6,34.14 5PH.4
  Bottom 0.254: v20.73,20.73 22.96,18.49 24.38,18.49 24.79,18.9 34.14,18.9 34.54,18.49 38.2,18.49 40.23,20.52 44.5,20.52 44.7,20.32 55.07,20.32 55.47,20.73 56.29,20.73 57.1,19.91 v63.6,19.91 | FRONT.5 45.11,38.61 45.11,34.95 54.66,34.95 55.27,35.56 56.49,35.56 57.1,34.95 57.1,32.92 62.18,32.92 63.4,34.14 5PH.4
SPARE-3  (via drill 0.33)
  Top 0.254: v29.06,16.87 28.25,17.68 IC1.22 | v64.41,16.66 66.04,18.29 66.04,34.14 5PH.5
  Bottom 0.254: v29.06,16.87 33.73,16.87 34.75,15.85 63.6,15.85 v64.41,16.66
SQUIRT-P2  (via drill 0.33)
  Top 0.254: v48.97,14.22 48.97,19.51 U1.13
  Bottom 0.254: v48.97,14.22 46.53,11.79 25.2,11.79 23.77,10.36 MEGASQUIRT.2
SQUIRT-P3  (via drill 0.33)
  Top 0.254: v49.78,13.41 49.78,19.3 49.99,19.51 U1.14
  Bottom 0.254: v49.78,13.41 44.3,7.93 44.3,5.89 28.45,5.89 25.4,8.94 22.35,8.94 21.13,10.16 MEGASQUIRT.3
SQUIRT-RX  (via drill 0.33)
  Top 0.254: v6.71,14.02 4.88,14.02 R-CURRLIM1.2 | v26.21,14.43 26.42,14.63 26.42,17.68 IC1.20 | v43.69,15.04 43.69,19.51 U1.9
  Bottom 0.254: v6.71,14.02 7.11,14.43 v26.21,14.43 43.08,14.43 v43.69,15.04
SQUIRT-TX  (via drill 0.33)
  Top 0.254: v11.18,13.61 11.18,13.82 9.96,13.82 B-CURRLIM1.2 | v26.62,13.61 27.23,14.22 27.23,17.68 IC1.21 | v31.29,13.61 31.29,13.21 43.89,13.21 44.5,13.82 44.5,19.1 44.91,19.51 U1.10
  Bottom 0.254: v11.18,13.61 v26.62,13.61 v31.29,13.61
THROT-IN
  Top 0.254: IC1.39 24.18,29.46 24.18,33.73 26.01,35.56 26.01,38.61 REAR-1.7
UCAP  (via drill 0.33)
  Top 0.254: v15.44,23.77 15.44,21.74 16.66,20.52 16.66,8.94 15.04,8.94 11.99,11.99 11.99,17.27 12.39,17.68 C1.1 | v17.07,23.77 17.48,23.37 18.29,23.37 IC1.6
  Bottom 0.254: v17.07,23.77 v15.44,23.77
VBAT1  (via drill 0.33)
  Top 0.254: v65.63,43.89 64.82,43.08 64.82,39.01 67.26,36.58 67.26,30.68 67.06,30.48 R9.2
  Bottom 0.254: v65.63,43.89 53.24,43.89 51.41,42.06 13.61,42.06 10.77,39.22 10.77,37.59 11.38,37.59 12.6,36.37 13.21,36.37 REAR-2.4
VBAT1MON  (via drill 0.33)
  Top 0.254: 65.02,30.48 65.02,26.82 R7.2 | 65.02,30.48 R9.1 65.02,30.48 | v23.57,26.21 23.57,29.06 23.37,29.26 IC1.40 | v45.31,28.45 45.72,28.85 v45.72,32.11 | v64.41,31.7 65.02,31.09 65.02,30.48
  Bottom 0.254: v23.57,26.21 24.38,25.4 26.42,25.4 26.82,24.99 41.86,24.99 v45.31,28.45 | v45.72,32.11 46.13,31.7 v64.41,31.7
VBAT2  (via drill 0.33)
  Top 0.254: v67.67,39.42 71.53,39.42 72.34,38.61 72.34,34.95 70.92,33.53 70.92,22.96 67.06,19.1 R10.2
  Bottom 0.254: v67.67,39.42 66.45,40.64 47.35,40.64 46.33,39.62 45.92,39.62 45.52,40.03 30.68,40.03 29.87,39.22 29.87,37.59 29.26,37.59 28.04,36.37 27.43,36.37 REAR-1.6
VBAT2MON  (via drill 0.33)
  Top 0.254: R10.1 65.02,19.1 65.02,22.76 R8.2 65.02,22.96 65.02,23.98 v64.41,24.59 | v25.81,24.59 25.81,29.26 IC1.37 | v47.35,24.59 48.56,23.37 50.39,23.37 v50.39,24.59
  Bottom 0.254: v47.35,24.59 v25.81,24.59 | v64.41,24.59 v50.39,24.59
VBUS
  Top 0.254: L1.1 10.57,26.01 8.53,23.98 7.92,23.98 CN1.VBUS
VCC  (via drill 0.33)
  Top 0.508: v25.4,15.24 25.4,14.22 25.2,14.02 C6.1 | v28.85,15.24 30.07,14.02 R6.1 | v21.74,15.24 21.74,17.68 IC1.14 | IC1.24 30.07,20.32 31.09,20.32 31.09,16.05 29.67,14.63 R6.1 | C11.2 47.95,15.24 47.75,15.04 47.75,11.58 46.94,10.77 46.94,9.75 49.17,7.52 49.78,7.52 BLUETOOTH.9 49.78,7.72 49.78,10.97 51.61,12.8 51.61,13.61 53.03,15.04 C7.1 53.03,15.24 52.83,15.44 52.83,19.51 U1.16 52.63,19.71 v52.63,22.56 | v30.28,5.08 30.28,13.82 R6.1 | 28.25,30.89 28.25,29.46 IC1.34 28.04,29.06 v28.04,27.03 | 28.25,30.89 28.25,32.31 R5.1 28.25,32.51 28.25,33.33 v29.26,34.34 | v22.96,33.73 22.96,32.51 R4.2 23.16,32.31 v23.16,30.89 | v20.12,30.68 20.12,29.46 IC1.44 | v27.43,30.89 28.04,30.89 28.25,30.89 | v47.35,29.26 48.77,30.68 48.77,36.17 FRONT.2 | IC2.3 64.62,45.72 63.6,44.7 63.6,39.42 C14.+ | 5PH.2 58.52,34.14 58.52,30.07 59.94,28.65 59.94,25.81 60.15,25.6 IC3.1 60.35,25.4 v60.35,23.77 | v40.23,27.03 40.23,28.65 40.64,29.06 J1.2
  Bottom 0.508: v28.85,15.24 v25.4,15.24 25.2,15.24 v21.74,15.24 | 30.28,5.28 47.75,5.28 49.78,7.32 BLUETOOTH.9 | 30.28,5.28 18.9,5.28 16.87,7.32 MEGASQUIRT.9 | v30.28,5.08 30.28,5.28 | v22.96,33.73 20.52,36.17 16.05,36.17 REAR-2.2 | v20.12,30.68 20.32,30.89 v23.16,30.89 23.37,30.89 v27.43,30.89 | v29.26,34.34 30.48,34.34 32.31,36.17 REAR-1.2 | v47.35,29.26 40.64,29.26 J1.2 | EXPAND.2 71.12,38 64.82,38 63.6,39.22 C14.+ 63.4,39.22 58.52,34.34 5PH.2 58.52,34.54 56.9,36.17 48.97,36.17 FRONT.2 | EXTPWR.2 72.34,23.77 v60.35,23.77 60.15,23.77 58.93,22.56 v52.63,22.56 | v40.23,27.03 v28.04,27.03
VIN  (via drill 0.33)
  Top 0.508: C13.+ 55.88,39.42 55.88,42.06 59.54,45.72 IC2.1 59.13,45.11 v61.16,43.08 | v72.95,42.27 72.95,31.9 72.54,31.5 VBATT.2
  Bottom 0.508: v72.95,42.27 72.14,43.08 v61.16,43.08
VOUT-1  (via drill 0.33)
  Top 0.254: v61.16,25.4 61.16,21.13 60.35,20.32 IC3.8 | v30.48,41.25 28.65,39.42 28.65,38.81 REAR-1.5
  Bottom 0.254: v61.16,25.4 70.1,34.34 71.73,34.34 72.34,34.95 72.34,39.42 68.68,39.42 66.85,41.25 v30.48,41.25
VOUT-2  (via drill 0.33)
  Top 0.254: v54.86,25.6 54.86,18.69 56.9,18.69 57.1,18.9 57.1,19.51 57.71,20.12 IC3.6 | v34.75,30.48 34.34,30.89 34.34,36.98 34.95,37.59 34.95,39.83 34.75,40.03 29.87,40.03 29.87,36.37 REAR-1.4
  Bottom 0.254: v54.86,25.6 49.17,31.29 43.89,31.29 42.06,33.12 40.23,33.12 39.42,32.31 39.42,30.48 v34.75,30.48
WHEEL-IN  (via drill 0.33)
  Top 0.254: v22.76,24.99 25.6,22.15 25.6,17.88 IC1.19 | v5.49,26.21 3.86,27.84 3.86,32.72 6.91,35.76 6.91,36.58 8.94,38.61 9.35,38.61 REAR-2.7
  Bottom 0.254: v22.76,24.99 21.95,25.81 18.09,25.81 17.27,26.62 5.89,26.62 v5.49,26.21

### Text on the board
tPlace: USB | EXP | 5v